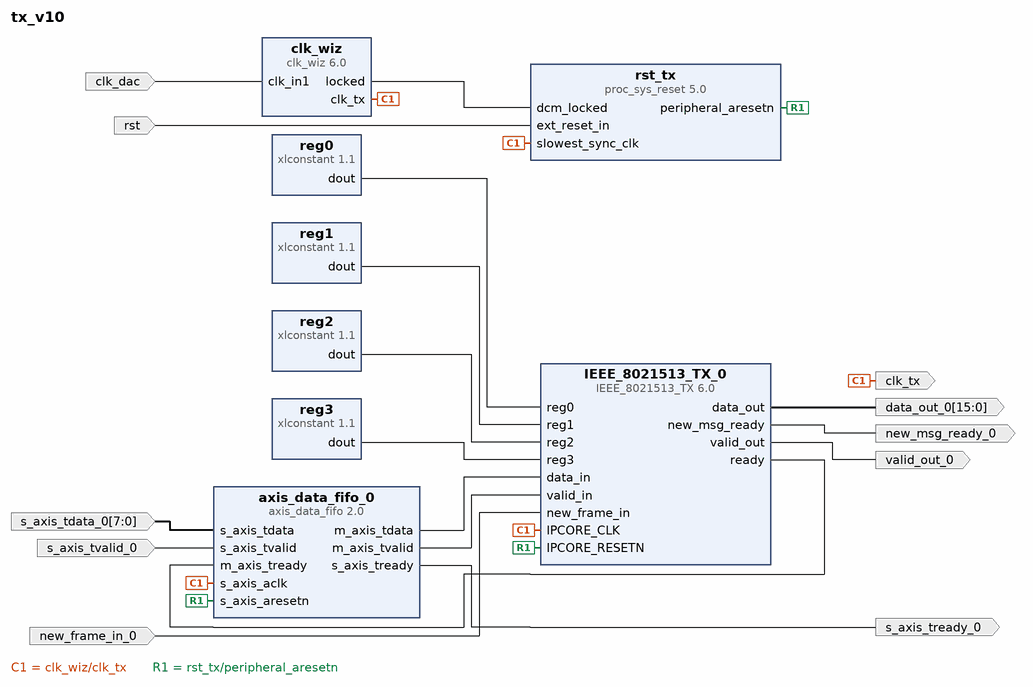
[diagram p0: block diagram of the top level]
# Vivado block design tx_v10, xc7z010clg400-1, Vivado 2024.1
create_bd_design tx_v10

create_bd_port -dir I -type clk clk_dac
set_property -dict {CONFIG.FREQ_HZ 125000000} [get_bd_ports clk_dac]
create_bd_port -dir I -type rst rst
set_property -dict {CONFIG.POLARITY ACTIVE_LOW} [get_bd_ports rst]
create_bd_port -dir O -from 15 -to 0 data_out_0
create_bd_port -dir I new_frame_in_0
create_bd_port -dir O valid_out_0
create_bd_port -dir O clk_tx
create_bd_port -dir I s_axis_tvalid_0
create_bd_port -dir O s_axis_tready_0
create_bd_port -dir I -from 7 -to 0 s_axis_tdata_0
create_bd_port -dir O new_msg_ready_0

create_bd_cell -type ip -vlnv xilinx.com:ip:clk_wiz:6.0 clk_wiz
set_property -dict [list \
  CONFIG.CLKIN1_JITTER_PS 80.0 \
  CONFIG.CLKOUT1_DRIVES BUFG \
  CONFIG.CLKOUT1_JITTER 125.031 \
  CONFIG.CLKOUT1_PHASE_ERROR 104.065 \
  CONFIG.CLKOUT1_REQUESTED_OUT_FREQ 125.000 \
  CONFIG.CLKOUT2_DRIVES BUFG \
  CONFIG.CLKOUT2_JITTER 189.933 \
  CONFIG.CLKOUT2_PHASE_ERROR 104.065 \
  CONFIG.CLKOUT2_REQUESTED_OUT_FREQ 15.625 \
  CONFIG.CLKOUT2_REQUESTED_PHASE 0.000 \
  CONFIG.CLKOUT2_USED false \
  CONFIG.CLKOUT3_DRIVES BUFG \
  CONFIG.CLKOUT3_JITTER 124.615 \
  CONFIG.CLKOUT3_PHASE_ERROR 96.948 \
  CONFIG.CLKOUT3_REQUESTED_OUT_FREQ 100.000 \
  CONFIG.CLKOUT3_USED false \
  CONFIG.CLKOUT4_DRIVES BUFG \
  CONFIG.CLKOUT5_DRIVES BUFG \
  CONFIG.CLKOUT6_DRIVES BUFG \
  CONFIG.CLKOUT7_DRIVES BUFG \
  CONFIG.CLK_OUT1_PORT clk_tx \
  CONFIG.CLK_OUT2_PORT clk_fifo_m \
  CONFIG.CLK_OUT3_PORT clk_out3 \
  CONFIG.MMCM_BANDWIDTH OPTIMIZED \
  CONFIG.MMCM_CLKFBOUT_MULT_F 7 \
  CONFIG.MMCM_CLKIN1_PERIOD 8.000 \
  CONFIG.MMCM_CLKIN2_PERIOD 10.0 \
  CONFIG.MMCM_CLKOUT0_DIVIDE_F 7 \
  CONFIG.MMCM_CLKOUT1_DIVIDE 1 \
  CONFIG.MMCM_CLKOUT1_PHASE 0.000 \
  CONFIG.MMCM_CLKOUT2_DIVIDE 1 \
  CONFIG.MMCM_COMPENSATION ZHOLD \
  CONFIG.NUM_OUT_CLKS 1 \
  CONFIG.PLL_CLKIN_PERIOD 8.000 \
  CONFIG.PRIMITIVE PLL \
  CONFIG.PRIM_IN_FREQ 125.000 \
  CONFIG.RESET_PORT resetn \
  CONFIG.RESET_TYPE ACTIVE_LOW \
  CONFIG.USE_RESET false \
] [get_bd_cells clk_wiz]
create_bd_cell -type ip -vlnv xilinx.com:ip:proc_sys_reset:5.0 rst_tx
set_property -dict {CONFIG.C_AUX_RST_WIDTH 4} [get_bd_cells rst_tx]
create_bd_cell -type ip -vlnv xilinx.com:ip:axis_data_fifo:2.0 axis_data_fifo_0
set_property -dict {CONFIG.FIFO_DEPTH 1024 CONFIG.IS_ACLK_ASYNC 0} [get_bd_cells axis_data_fifo_0]
create_bd_cell -type ip -vlnv xilinx.com:ip:xlconstant:1.1 reg0
set_property -dict {CONFIG.CONST_VAL 147 CONFIG.CONST_WIDTH 32} [get_bd_cells reg0]
create_bd_cell -type ip -vlnv xilinx.com:ip:xlconstant:1.1 reg1
set_property -dict {CONFIG.CONST_VAL 17 CONFIG.CONST_WIDTH 32} [get_bd_cells reg1]
create_bd_cell -type ip -vlnv xilinx.com:ip:xlconstant:1.1 reg2
set_property -dict {CONFIG.CONST_VAL 65792 CONFIG.CONST_WIDTH 32} [get_bd_cells reg2]
create_bd_cell -type ip -vlnv xilinx.com:ip:xlconstant:1.1 reg3
set_property -dict {CONFIG.CONST_VAL 66063 CONFIG.CONST_WIDTH 32} [get_bd_cells reg3]
create_bd_cell -type ip -vlnv user.org:ip:IEEE_8021513_TX:6.0 IEEE_8021513_TX_0

# ---- connections ----

connect_bd_net [get_bd_pins IEEE_8021513_TX_0/data_out] [get_bd_ports data_out_0]
connect_bd_net [get_bd_pins IEEE_8021513_TX_0/new_msg_ready] [get_bd_ports new_msg_ready_0]
connect_bd_net [get_bd_pins IEEE_8021513_TX_0/ready] [get_bd_pins axis_data_fifo_0/m_axis_tready]
connect_bd_net [get_bd_pins IEEE_8021513_TX_0/valid_out] [get_bd_ports valid_out_0]
connect_bd_net [get_bd_pins axis_data_fifo_0/m_axis_tdata] [get_bd_pins IEEE_8021513_TX_0/data_in]
connect_bd_net [get_bd_pins axis_data_fifo_0/m_axis_tvalid] [get_bd_pins IEEE_8021513_TX_0/valid_in]
connect_bd_net [get_bd_pins axis_data_fifo_0/s_axis_tready] [get_bd_ports s_axis_tready_0]
connect_bd_net -net clk_100MHz_1 [get_bd_ports clk_dac] [get_bd_pins clk_wiz/clk_in1]
connect_bd_net -net clk_wiz_clk_out1 [get_bd_pins clk_wiz/clk_tx] \
  [get_bd_ports clk_tx] [get_bd_pins axis_data_fifo_0/s_axis_aclk] [get_bd_pins rst_tx/slowest_sync_clk] \
  [get_bd_pins IEEE_8021513_TX_0/IPCORE_CLK]
connect_bd_net [get_bd_pins clk_wiz/locked] [get_bd_pins rst_tx/dcm_locked]
connect_bd_net -net new_frame_in_0_1 [get_bd_ports new_frame_in_0] [get_bd_pins IEEE_8021513_TX_0/new_frame_in]
connect_bd_net [get_bd_pins reg0/dout] [get_bd_pins IEEE_8021513_TX_0/reg0]
connect_bd_net [get_bd_pins reg1/dout] [get_bd_pins IEEE_8021513_TX_0/reg1]
connect_bd_net [get_bd_pins reg2/dout] [get_bd_pins IEEE_8021513_TX_0/reg2]
connect_bd_net [get_bd_pins reg3/dout] [get_bd_pins IEEE_8021513_TX_0/reg3]
connect_bd_net -net reset_rtl_1 [get_bd_ports rst] [get_bd_pins rst_tx/ext_reset_in]
connect_bd_net -net rst_clk_wiz_100M_peripheral_aresetn [get_bd_pins rst_tx/peripheral_aresetn] \
  [get_bd_pins axis_data_fifo_0/s_axis_aresetn] [get_bd_pins IEEE_8021513_TX_0/IPCORE_RESETN]
connect_bd_net -net s_axis_tdata_0_1 [get_bd_ports s_axis_tdata_0] [get_bd_pins axis_data_fifo_0/s_axis_tdata]
connect_bd_net -net s_axis_tvalid_0_1 [get_bd_ports s_axis_tvalid_0] [get_bd_pins axis_data_fifo_0/s_axis_tvalid]

validate_bd_design
save_bd_design
